# EAGLE design code_loader (EAGLE 5.06)
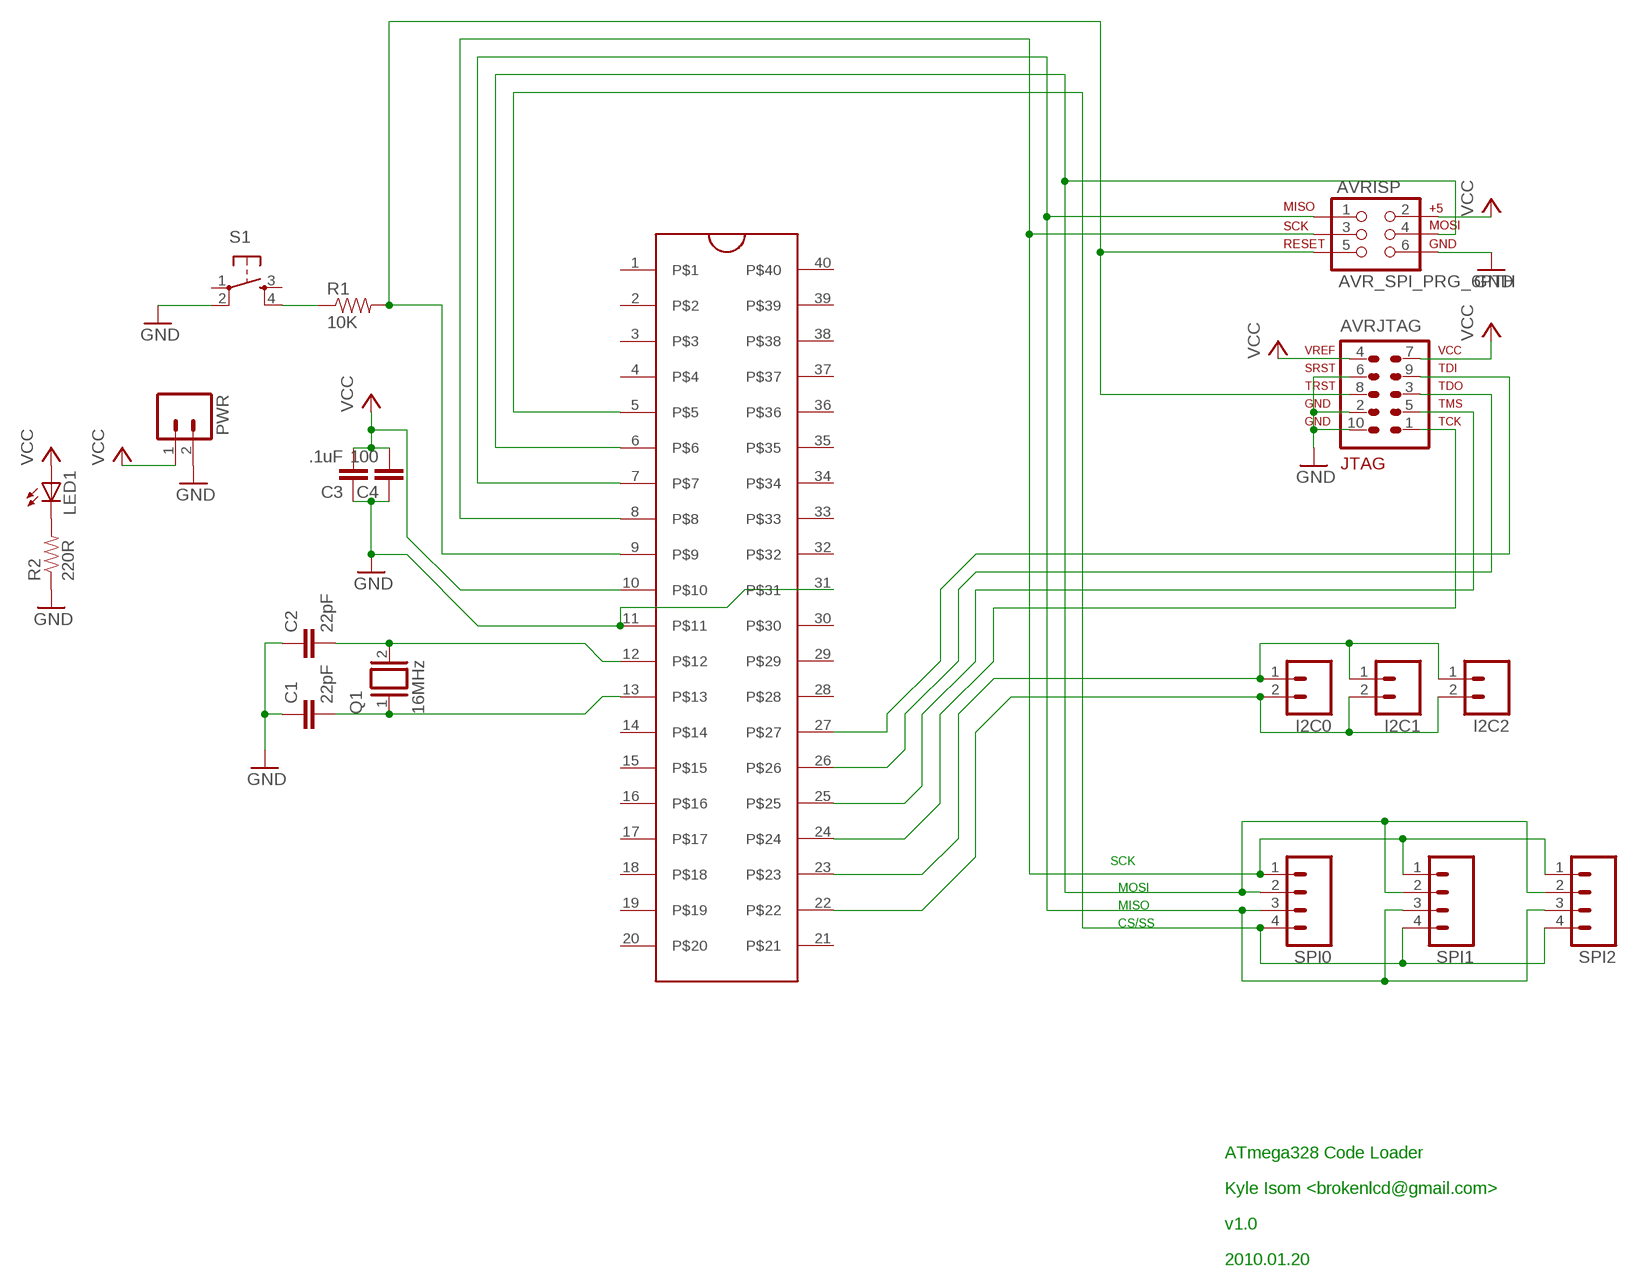
[diagram p0: schematic, sheet 1]

## Parts
ATMEGA164/324/644  ZIFSOCKET-40-6DIL40-6-ZIF_SOCKET  [DIL40-6-ZIF_SOCKET]
AVRISP  AVR_SPI_PRG_6PTH  [2X3]
AVRJTAG  AVR-JTAG-10  [AVR-JTAG-10]
C1  22pF  CAPPTH1  [CAP-PTH-5MM]
C2  22pF  CAPPTH1  [CAP-PTH-5MM]
C3  .1uF  CAPPTH1  [CAP-PTH-5MM]
C4  100  CAPPTH1  [CAP-PTH-5MM]
I2C0  M02LOCK  [1X02_LOCK]
I2C1  M02LOCK  [1X02_LOCK]
I2C2  M02LOCK  [1X02_LOCK]
LED1  LED5MM  [LED5MM]
PWR  M02LOCK  [1X02_LOCK]
Q1  16MHz  XTAL  [Q]
R1  10K  RESISTORPTH1  [AXIAL-0.3]
R2  220R  RESISTORPTH1  [AXIAL-0.3]
S1  TAC_SWITCHPTH  [TACTILE-PTH]
SPI0  M04LOCK  [1X04_LOCK]
SPI1  M04LOCK  [1X04_LOCK]
SPI2  M04LOCK  [1X04_LOCK]

## Nets
GND: ATMEGA164/324/644.11 ATMEGA164/324/644.31 AVRISP.6 AVRJTAG.2 AVRJTAG.6 AVRJTAG.10 C1.1 C2.1 C3.1 C4.1 PWR.2 R2.P$1 S1.2
N$1: ATMEGA164/324/644.12 C2.2 Q1.2
N$2: ATMEGA164/324/644.13 C1.2 Q1.1
N$3: ATMEGA164/324/644.25 AVRJTAG.5
N$4: LED1.K(C) R2.P$2
N$5: R1.P$1 S1.4
N$6: ATMEGA164/324/644.9 AVRISP.5 AVRJTAG.8 R1.P$2
N$7: ATMEGA164/324/644.23 I2C0.1 I2C1.1 I2C2.1
N$8: ATMEGA164/324/644.22 I2C0.2 I2C1.2 I2C2.2
N$9: ATMEGA164/324/644.8 AVRISP.3 SPI0.1 SPI1.1 SPI2.1
N$10: ATMEGA164/324/644.6 AVRISP.4 SPI0.2 SPI1.2 SPI2.2
N$11: ATMEGA164/324/644.5 SPI0.4 SPI1.4 SPI2.4
N$12: ATMEGA164/324/644.7 AVRISP.1 SPI0.3 SPI1.3 SPI2.3
N$13: ATMEGA164/324/644.24 AVRJTAG.1
N$14: ATMEGA164/324/644.26 AVRJTAG.3
N$15: ATMEGA164/324/644.27 AVRJTAG.9
VCC: ATMEGA164/324/644.10 AVRISP.2 AVRJTAG.4 AVRJTAG.7 C3.2 C4.2 LED1.A PWR.1
Unconnected: ATMEGA164/324/644.1 ATMEGA164/324/644.2 ATMEGA164/324/644.3 ATMEGA164/324/644.4 ATMEGA164/324/644.14 ATMEGA164/324/644.15 ATMEGA164/324/644.16 ATMEGA164/324/644.17 ATMEGA164/324/644.18 ATMEGA164/324/644.19 ATMEGA164/324/644.20 ATMEGA164/324/644.21 ATMEGA164/324/644.28 ATMEGA164/324/644.29 ATMEGA164/324/644.30 ATMEGA164/324/644.32 ATMEGA164/324/644.33 ATMEGA164/324/644.34 ATMEGA164/324/644.35 ATMEGA164/324/644.36 ATMEGA164/324/644.37 ATMEGA164/324/644.38 ATMEGA164/324/644.39 ATMEGA164/324/644.40 S1.1 S1.3

## Notes on the sheet
- SCK
- MOSI
- MISO
- CS/SS
- ATmega328 Code Loader
- Kyle Isom <brokenlcd@gmail.com>
- v1.0
- 2010.01.20

## Library data of the parts
ATMEGA164/324/644 = SparkFun:ZIFSOCKET-40-6
AVRISP = SparkFun:AVR_SPI_PRG_6: AVR ISP 6 Pin This is the reduced ISP connector for AVR programming. Common on Arduino. This footprint will take up less PCB space and can be used with a 10-pin to 6-pin adapter such as SKU: BOB-08508
AVRJTAG = avr-6:AVR-JTAG-10: AVR JTAG Debug/Programming Header
C1-C4 = SparkFun:CAP: Capacitor Standard 0603 ceramic capacitor, and 0.1" leaded capacitor.
I2C0 I2C1 I2C2 PWR = SparkFun:M02: Header 2 Standard 2-pin 0.1" header. Use with straight break away headers (SKU : PRT-00116), right angle break away headers (PRT-00553), swiss pins (PRT-00743), machine pins (PRT-00117), and female headers (PRT-00115). Molex polarized connector foot print use with SKU : PRT-08233 with associated crimp pins and housings.
LED1 = led:LED: LED OSRAM: - CHIPLED LG R971, LG N971, LY N971, LG Q971, LY Q971, LO R971, LY R971 LH N974, LH R974 LS Q976, LO Q976, LY Q976 LO Q996 - Hyper CHIPLED LW Q18S LB Q993, LB Q99A, LB R99A - SideLED LS A670, LO A670, LY A670, LG A670, LP A670 LB A673, LV A673, LT A673, LW A673 LH A674 LY A675 LS A676, LA A676, LO A676, LY A676, LW A676 LS A679, LY A679, LG A679 - Hyper Micro SIDELED® LS Y876, LA Y876, LO Y876, LY Y876 LT Y87S - SmartLED LW L88C, LW L88S LB L89C, LB L89S, LG L890 LS L89K, LO L89K, LY L89K LS L896, LA L896, LO L896, LY L896 - TOPLED LS T670, LO T670, LY T670, LG T670, LP T670 LSG T670, LSP T670, LSY T670, LOP T670, LYG T670 LG T671, LOG T671, LSG T671 LB T673, LV T673, LT T673, LW T673 LH T674 LS T676, LA T676, LO T676, LY T676, LB T676, LH T676, LSB T676, LW T676 LB T67C, LV T67C, LT T67C, LS T67K, LO T67K, LY T67K, LW E67C LS E67B, LA E67B, LO E67B, LY E67B, LB E67C, LV E67C, LT E67C LW T67C LS T679, LY T679, LG T679 LS T770, LO T770, LY T770, LG T770, LP T770 LB T773, LV T773, LT T773, LW T773 LH T774 LS E675, LA E675, LY E675, LS T675 LS T776, LA T776, LO T776, LY T776, LB T776 LHGB T686 LT T68C, LB T68C - Hyper Mini TOPLED® LB M676 - Mini TOPLED Santana® LG M470 LS M47K, LO M47K, LY M47K Source: http://www.osram.convergy.de LUXEON: - LUMILED® LXK2-PW12-R00, LXK2-PW12-S00, LXK2-PW14-U00, LXK2-PW14-V00 LXK2-PM12-R00, LXK2-PM12-S00, LXK2-PM14-U00 LXK2-PE12-Q00, LXK2-PE12-R00, LXK2-PE12-S00, LXK2-PE14-T00, LXK2-PE14-U00 LXK2-PB12-K00, LXK2-PB12-L00, LXK2-PB12-M00, LXK2-PB14-N00, LXK2-PB14-P00, LXK2-PB14-Q00 LXK2-PR12-L00, LXK2-PR12-M00, LXK2-PR14-Q00, LXK2-PR14-R00 LXK2-PD12-Q00, LXK2-PD12-R00, LXK2-PD12-S00 LXK2-PH12-R00, LXK2-PH12-S00 LXK2-PL12-P00, LXK2-PL12-Q00, LXK2-PL12-R00 Source: www.luxeon.com KINGBRIGHT: KA-3528ASYC Source: www.kingbright.com
Q1 = special:XTAL: CRYSTAL
R1 R2 = SparkFun:RESISTOR: Resistor Basic schematic elements and footprints for 0603, 1206, and PTH 1/10th watt (small) resistors.
S1 = SparkFun:TAC_SWITCH: Momentary Switch Button commonly used for reset or general input. Spark Fun Electronics SKU : COM-00097
SPI0 SPI1 SPI2 = SparkFun:M04: Header 4 Standard 4-pin 0.1" header. Use with straight break away headers (SKU : PRT-00116), right angle break away headers (PRT-00553), swiss pins (PRT-00743), machine pins (PRT-00117), and female headers (PRT-00115). Molex polarized connector foot print use with SKU : PRT-08231 with associated crimp pins and housings.

## Board
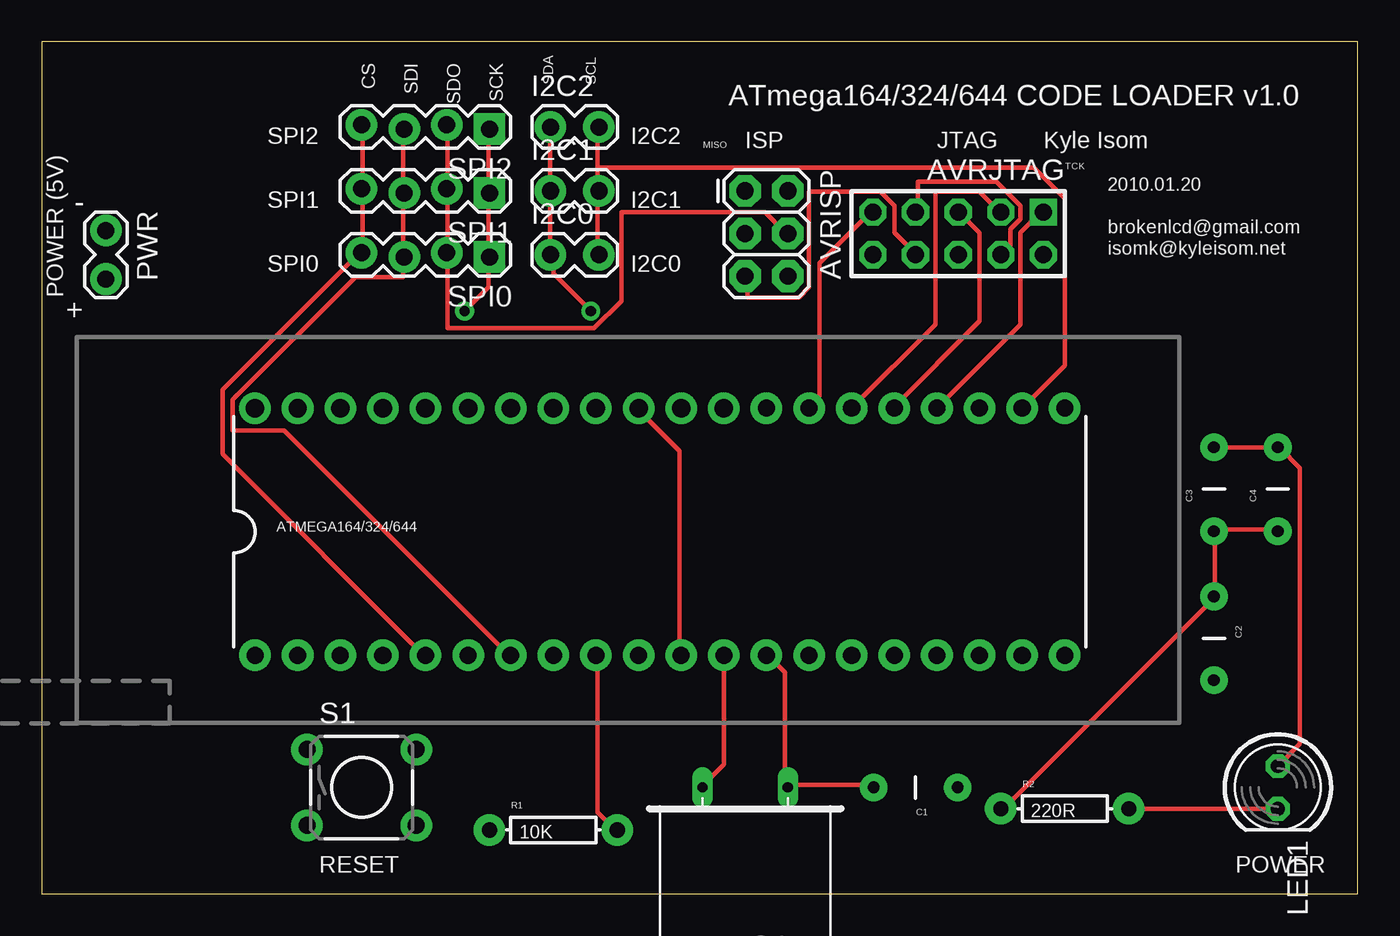
[diagram p1: board, top side]
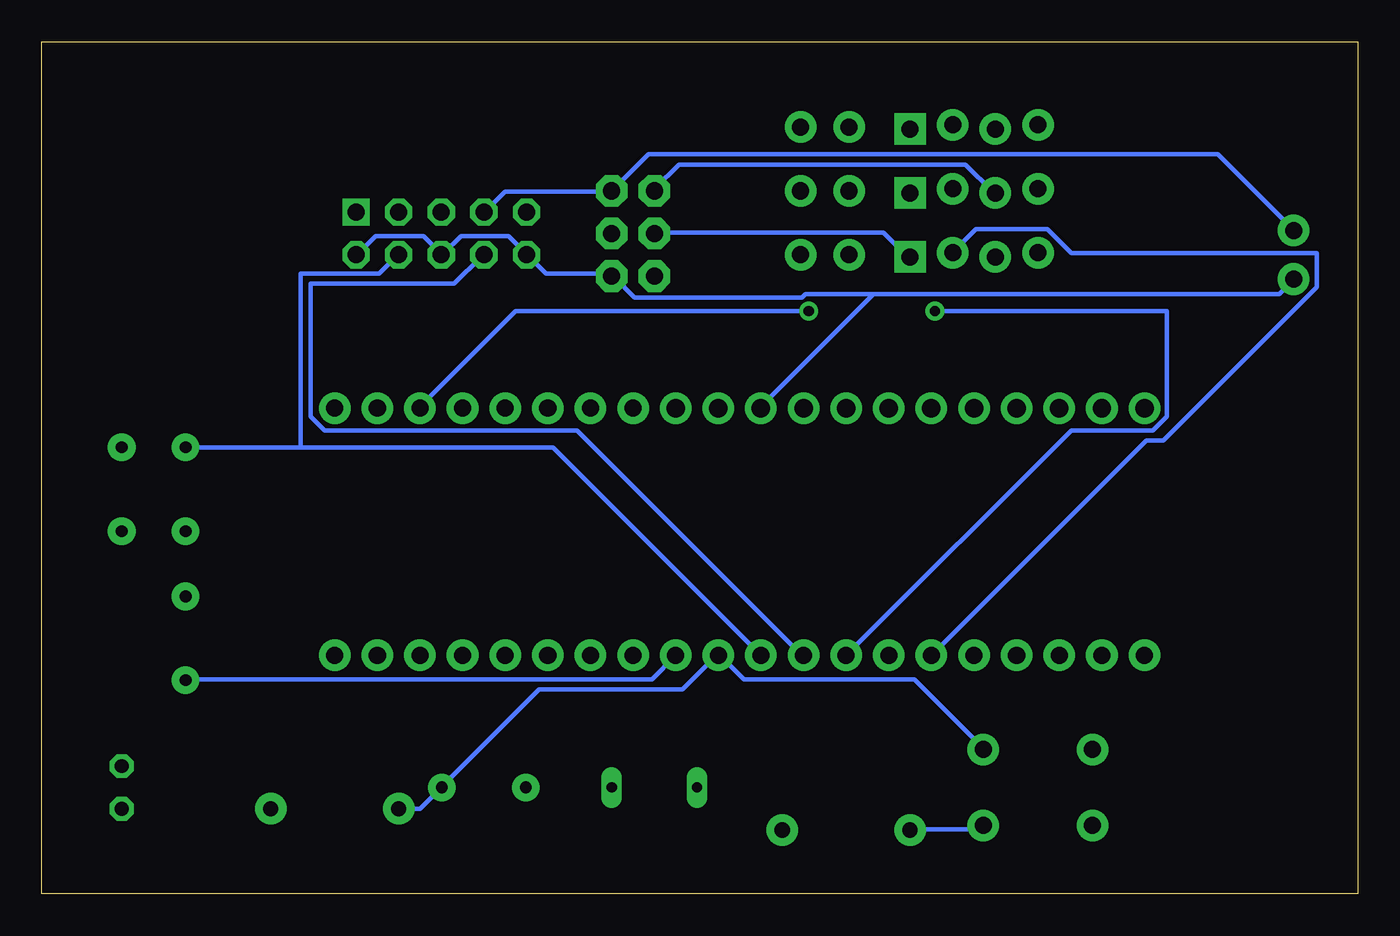
[diagram p2: board, bottom side, seen from below]

Size 78.41 x 50.79 mm. Coordinates in mm from the lower left corner, seen from the top.
Outline: 0,0 78.41,0 78.41,50.79 0,50.79 0,0
Copper layers (1*16): Top 0.035mm / dielectric 1.5mm / Bottom 0.035mm
Design rules "SparkFun": minimum track width 8mil, minimum drill 20mil, track to track 8mil, track to pad 8mil, pad to pad 8mil, via to via 8mil, smd to smd 8mil, copper to edge 10mil, drill to drill 8mil, minimum pad ring 12mil, minimum via ring 10mil, stop-mask expansion 4mil, vias tented up to drill 25mil, thermal gap 10mil

### Footprints (pad centres in the part's own frame; a part is rotated, then mirrored left to right if it is on the bottom)
DIL40-6-ZIF_SOCKET = drill 1.016 pad 1.88 round: 1 -24.13,-7.366; 2 -21.59,-7.366; 3 -19.05,-7.366; 4 -16.51,-7.366; 5 -13.97,-7.366; 6 -11.43,-7.366; 7 -8.89,-7.366; 8 -6.35,-7.366; 9 -3.81,-7.366; 10 -1.27,-7.366; 11 1.27,-7.366; 12 3.81,-7.366; 13 6.35,-7.366; 14 8.89,-7.366; 15 11.43,-7.366; 16 13.97,-7.366; 17 16.51,-7.366; 18 19.05,-7.366; 19 21.59,-7.366; 20 24.13,-7.366; 21 24.13,7.366; 22 21.59,7.366; 23 19.05,7.366; 24 16.51,7.366; 25 13.97,7.366; 26 11.43,7.366; 27 8.89,7.366; 28 6.35,7.366 | drill 1.1 pad 1.88 round: 29 3.81,7.366; 30 1.27,7.366; 31 -1.27,7.366; 32 -3.81,7.366; 33 -6.35,7.366; 34 -8.89,7.366; 35 -11.43,7.366; 36 -13.97,7.366; 37 -16.51,7.366; 38 -19.05,7.366; 39 -21.59,7.366; 40 -24.13,7.366
2X3 = drill 1.016 pad 1.88 octagon: 1 0,0; 2 0,2.54; 3 2.54,0; 4 2.54,2.54; 5 5.08,0; 6 5.08,2.54
AVR-JTAG-10 = drill 1.016 square: 1 -5.08,-1.27 | drill 1.016 octagon: 2 -5.08,1.27; 3 -2.54,-1.27; 4 -2.54,1.27; 5 0,-1.27; 6 0,1.27; 7 2.54,-1.27; 8 2.54,1.27; 9 5.08,-1.27; 10 5.08,1.27
CAP-PTH-5MM = drill 0.7 pad 1.651 round: 1 -2.5,0; 2 2.5,0
1X02_LOCK = drill 1.016 pad 1.88 round: 1 -0.178,0; 2 2.718,0
LED5MM = drill 0.813 octagon: A -1.27,0; K 1.27,0
Q = drill 0.61 long: 1 -2.54,-7.62; 2 2.54,-7.62
AXIAL-0.3 = drill 0.9 pad 1.88 round: P$1 -3.81,0; P$2 3.81,0
TACTILE-PTH = drill 1.016 pad 1.88 round: 1 -3.251,2.261; 2 3.251,2.261; 3 -3.251,-2.261; 4 3.251,-2.261
1X04_LOCK = drill 1.016 pad 1.88 square: 1 0,0.127 | drill 1.016 pad 1.88 round: 2 2.54,-0.127; 3 5.08,0.127; 4 7.62,-0.127

### Placement (x,y rotation side)
ATMEGA164/324/644  36.83,21.59 0 top
AVRISP  41.91,41.91 270 top
AVRJTAG  54.61,39.37 180 top
C1  52.07,6.35 180 top
C2  69.85,15.24 270 top
C3  69.85,24.13 90 top
C4  73.66,24.13 90 top
I2C0  30.48,38.1 0 top
I2C1  30.48,41.91 0 top
I2C2  30.48,45.72 0 top
LED1  73.66,6.35 270 top
PWR  3.81,39.37 270 top
Q1  41.91,-1.27 180 top
R1  30.48,3.81 0 top
R2  60.96,5.08 0 top
S1  19.05,6.35 0 top
SPI0  26.67,38.1 180 top
SPI1  26.67,41.91 180 top
SPI2  26.67,45.72 180 top

### Tracks (layer width: path | path; a pad name or v marks a point on that pad's centre or on a via)
GND
  Top 0.254: C4.1 73.56,21.74 69.9,21.74 C3.1 69.9,21.54 69.9,17.88 C2.1 69.7,17.68 69.7,17.48 57.3,5.08 R2.P$1 | ATMEGA164/324/644.31 35.56,28.85 38,26.42 38,14.22 ATMEGA164/324/644.11
  Bottom 0.254: R2.P$1 55.88,5.08 54.66,6.3 C1.1 54.46,6.5 48.77,12.19 40.23,12.19 38.2,14.22 ATMEGA164/324/644.11 38,14.22 36.58,12.8 26.42,12.8 22.35,8.74 S1.2 | AVRJTAG.2 59.54,38.2 58.52,39.22 55.68,39.22 54.66,38.2 AVRJTAG.6 54.46,38.2 53.44,39.22 50.6,39.22 49.58,38.2 AVRJTAG.10 49.38,38 48.36,36.98 44.5,36.98 AVRISP.6 44.3,36.78 43.08,35.56 33.12,35.56 32.92,35.76 28.85,35.76 | 28.85,35.76 4.67,35.76 3.86,36.58 PWR.2 | 28.85,35.76 35.56,29.06 ATMEGA164/324/644.31
N$1
  Top 0.254: ATMEGA164/324/644.12 40.64,7.72 39.42,6.5 Q1.2
  Bottom 0.254: ATMEGA164/324/644.12 42.06,12.8 69.7,12.8 C2.2
N$2
  Top 0.254: C1.2 49.38,6.5 44.5,6.5 Q1.1 44.3,6.5 44.3,13.21 43.28,14.22 ATMEGA164/324/644.13
N$3
  Top 0.254: AVRJTAG.5 54.66,40.64 55.88,39.42 55.88,34.14 50.8,29.06 ATMEGA164/324/644.25
N$4
  Top 0.254: R2.P$2 LED1.K
N$5
  Bottom 0.254: S1.4 22.35,4.06 22.55,3.86 26.62,3.86 R1.P$1
N$6
  Top 0.254: R1.P$2 34.14,3.86 33.12,4.88 33.12,14.22 ATMEGA164/324/644.9 | AVRJTAG.8 52.02,38.2 50.8,39.42 50.8,41.05 49.99,41.86 45.72,41.86 45.72,36.17 45.11,35.56 42.06,35.56 42.06,36.78 AVRISP.5
  Bottom 0.254: ATMEGA164/324/644.9 33.12,14.22 46.53,27.64 61.57,27.64 62.38,28.45 62.38,36.37 53.85,36.37 52.22,38 AVRJTAG.8
N$7  (via drill 0.61)
  Top 0.254: I2C2.1 30.28,45.72 30.28,42.06 I2C1.1 30.28,41.86 30.28,38.2 I2C0.1 30.48,38 30.48,36.98 v32.72,34.75
  Bottom 0.254: v32.72,34.75 50.19,34.75 55.88,29.06 ATMEGA164/324/644.23
N$8
  Top 0.254: I2C0.2 33.12,38.2 33.12,41.86 I2C1.2 33.12,42.06 33.12,43.28 | 33.12,43.28 33.12,45.72 I2C2.2 | 33.12,43.28 59.13,43.28 60.96,41.45 60.96,31.5 ATMEGA164/324/644.22
N$9  (via drill 0.61)
  Top 0.254: SPI2.1 26.62,45.52 26.62,41.86 SPI1.1 26.62,41.66 26.62,38 SPI0.1 26.62,37.8 26.62,36.17 v25.2,34.75
  Bottom 0.254: ATMEGA164/324/644.8 17.07,27.64 12.19,27.64 11.38,28.45 11.38,34.75 v25.2,34.75 | AVRISP.3 41.86,39.42 28.25,39.42 26.82,38 SPI0.1
N$10
  Top 0.254: SPI2.2 24.18,45.72 24.18,42.06 SPI1.2 24.18,41.86 24.18,38.41 SPI0.2 24.18,38.2 24.18,33.73 32.92,33.73 34.54,35.36 34.54,40.64 43.08,40.64 44.3,39.42 AVRISP.4
  Bottom 0.254: ATMEGA164/324/644.6 12.6,27.03 11.58,27.03 2.44,36.17 2.44,38.2 17.07,38.2 18.49,39.62 22.76,39.62 23.98,38.41 SPI0.2
N$11
  Top 0.254: SPI2.4 19.1,45.72 19.1,42.06 SPI1.4 19.1,41.86 19.1,38.41 SPI0.4 18.9,38.2 10.77,30.07 10.77,26.21 22.76,14.22 ATMEGA164/324/644.5
N$12
  Top 0.254: SPI2.3 21.54,45.52 21.54,41.86 SPI1.3 21.54,41.66 21.54,38 SPI0.3 21.54,37.8 21.54,36.78 18.69,36.78 11.38,29.46 11.38,27.64 14.43,27.64 27.84,14.22 ATMEGA164/324/644.7
  Bottom 0.254: AVRISP.1 41.86,42.06 40.44,43.48 23.37,43.48 21.74,41.86 SPI1.3
N$13
  Top 0.254: AVRJTAG.1 59.54,40.64 58.32,39.42 58.32,33.93 ATMEGA164/324/644.24
N$14
  Top 0.254: AVRJTAG.3 57.1,40.64 55.88,41.86 53.24,41.86 53.24,33.93 ATMEGA164/324/644.26
N$15
  Top 0.254: AVRJTAG.9 49.38,40.64 46.33,37.59 46.33,29.67 45.72,29.06 ATMEGA164/324/644.27
VCC
  Top 0.254: LED1.A 74.98,8.94 74.98,25.4 73.76,26.62 C4.2 73.56,26.62 69.9,26.62 C3.2 | AVRJTAG.4 57.3,38.2 57.71,38.61 57.71,39.62 58.32,40.23 58.32,41.05 56.9,42.47 52.22,42.47 52.22,40.64 AVRJTAG.7
  Bottom 0.254: ATMEGA164/324/644.10 47.95,26.62 62.99,26.62 | 62.99,26.62 69.7,26.62 C3.2 | AVRJTAG.7 52.02,40.64 50.8,41.86 44.5,41.86 AVRISP.2 42.27,44.09 8.33,44.09 3.86,39.62 PWR.1 | 62.99,26.62 62.99,36.98 58.32,36.98 57.3,38 AVRJTAG.4

### Text on the board
tPlace: CS | SDI | SDO | SCK | SDA | SCL | ATmega164/324/644 CODE LOADER v1.0 | SPI2 | I2C2 | MISO | ISP | JTAG | Kyle Isom | TCK | - | SPI1 | I2C1 | 2010.01.20 | brokenlcd@gmail.com | SPI0 | I2C0 | isomk@kyleisom.net | POWER (5V) | + | RESET | POWER